# EAGLE design furby_shield_v1b (EAGLE 6.3)
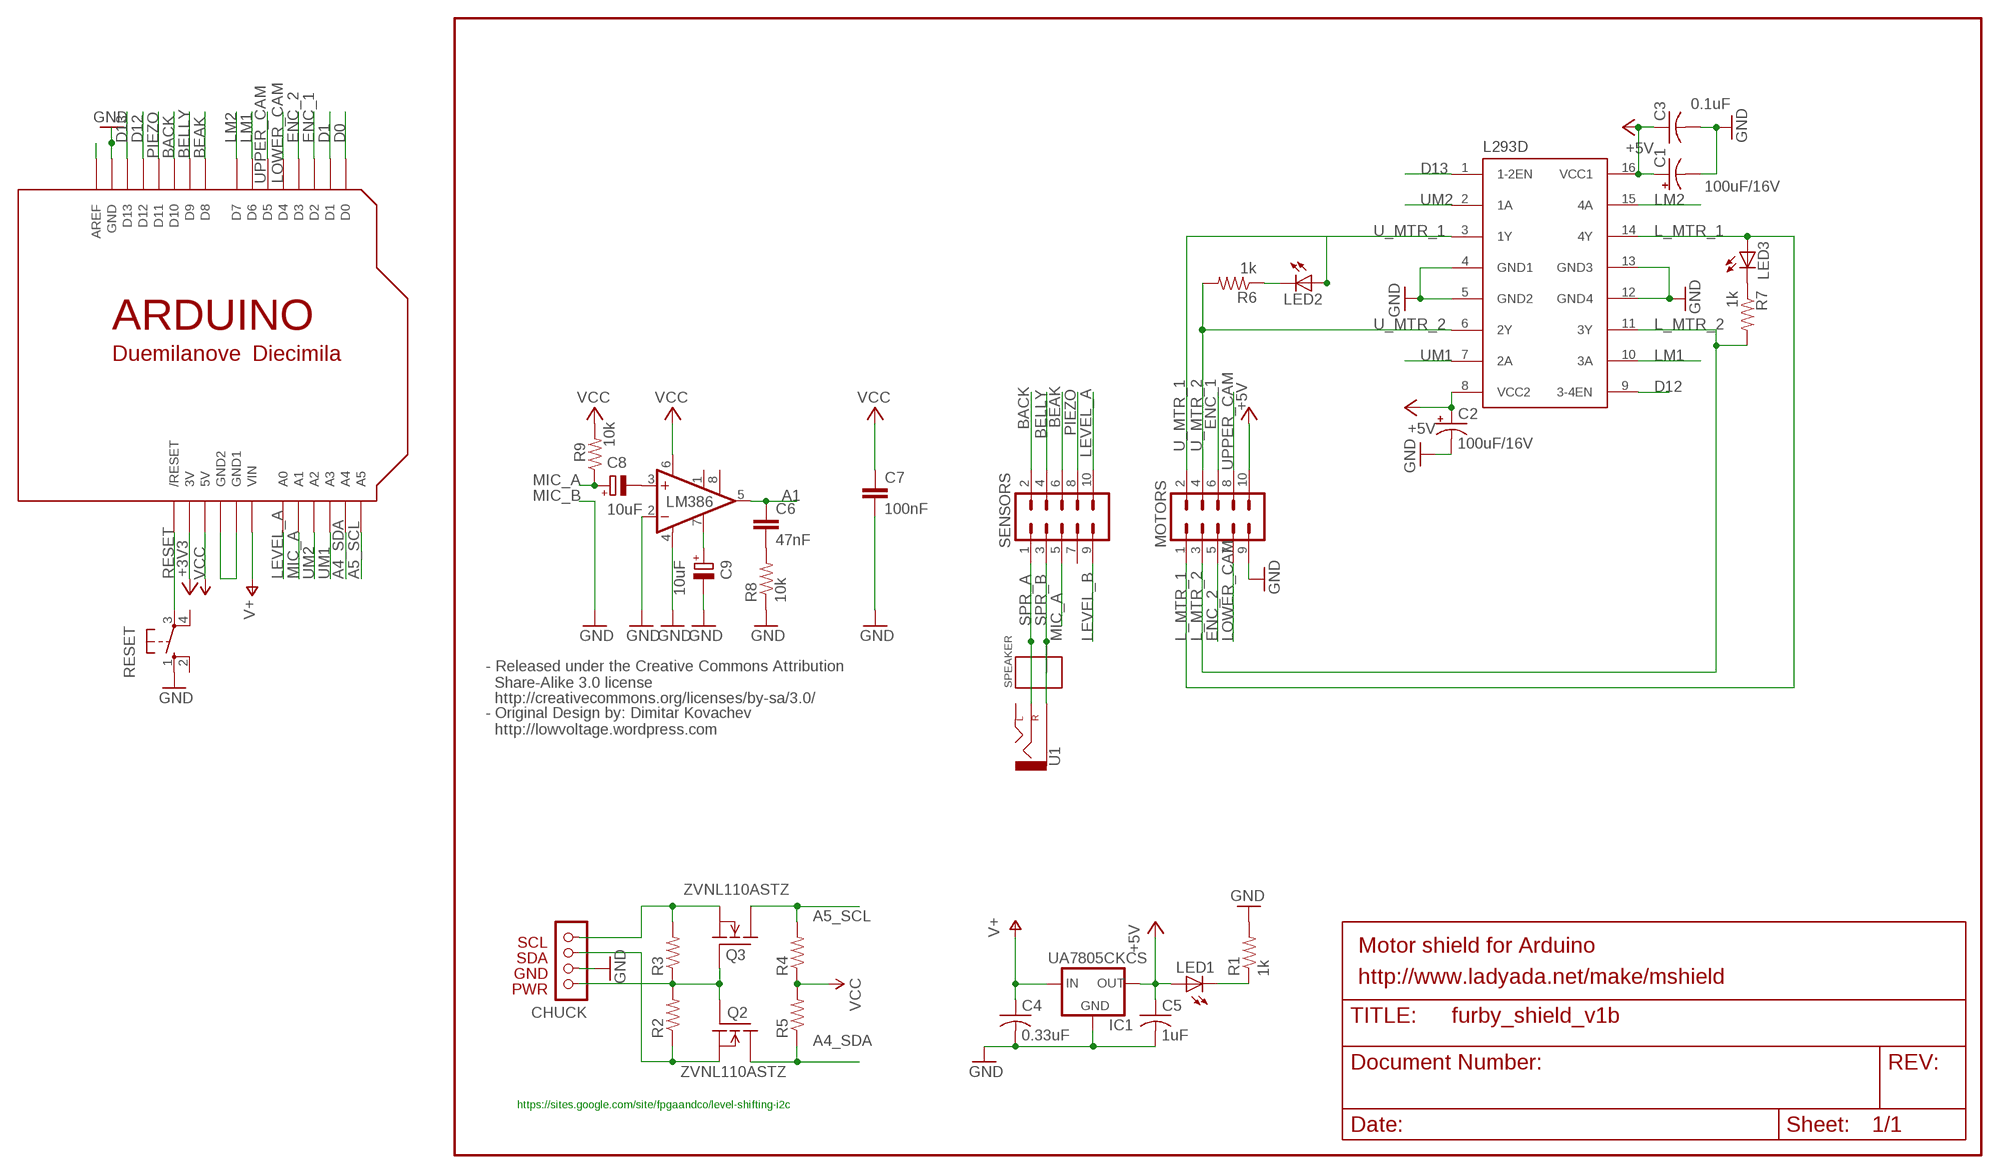
[diagram p0: schematic, sheet 1]

## Parts
C1  100uF/16V  CPOL-USE2.5-6  [E2,5-6]
C2  100uF/16V  CPOL-USE2.5-6  [E2,5-6]
C3  0.1uF  C-US025-025X050  [C025-025X050]
C4  0.33uF  C-US025-024X044  [C025-024X044]
C5  1uF  C-US025-024X044  [C025-024X044]
C6  47nF  C-EU025-030X050  [C025-030X050]
C7  100nF  C-EU025-025X050  [C025-025X050]
C8  10uF  CPOL-EUE2.5-6  [E2,5-6]
C9  10uF  CPOL-EUE2.5-6  [E2,5-6]
CHUCK  NUNCHUCK  [CONN]
IC1  UA7805CKCS  V_REG_78XX-TO-220  [TO-220-ALT]
L293D  L293E  [DIL16]
LED1  LED3MM  [LED3MM]
LED2  LED3MM  [LED3MM]
LED3  LED3MM  [LED3MM]
LM386  LM386N-1  [DIL08]
MOTORS  M05X2SHD  [2X5-SHROUDED]
Q2  ZVNL110ASTZ  FQN1N50CI  [TO92-INLINE]
Q3  ZVNL110ASTZ  FQN1N50CI  [TO92-INLINE]
R1  1k  R-US_0204/5  [0204/5]
R2  R-US_0204/7  [0204/7]
R3  R-US_0204/7  [0204/7]
R4  R-US_0204/7  [0204/7]
R5  R-US_0204/7  [0204/7]
R6  1k  R-US_0204/5  [0204/5]
R7  1k  R-US_0204/5  [0204/5]
R8  10k  R-US_0204/7  [0204/7]
R9  10k  R-US_0204/7  [0204/7]
RESET  10-XX  [B3F-10XX]
SENSORS  M05X2SHD  [2X5-SHROUDED]
SPEAKER  TERMINAL2  [TERMINAL_2]
U1  AUDIO-JACKPTH  [AUDIO-JACK]
U$1  ARDUINO-NOHOLE  [ARDUINO-NOHOLE]

## Nets
+3V3: CHUCK.PWR Q2.2(G) Q3.2(G) R2.2 R3.1 U$1.3V
+5V: C1.+ C2.+ C3.1 C5.1 IC1.OUT L293D.8(VCC2) L293D.16(VCC1) LED1.A MOTORS.10
A1: C6.1 LM386.5(OUT)
A4_SDA: Q2.1(D) R5.1 U$1.A4
A5_SCL: Q3.1(D) R4.2 U$1.A5
BACK: SENSORS.2 U$1.D10
BEAK: SENSORS.6 U$1.D8
BELLY: SENSORS.4 U$1.D9
D0: U$1.D0
D1: U$1.D1
D12: L293D.9(3-4EN) U$1.D12
D13: L293D.1(1-2EN) U$1.D13
ENC_1: MOTORS.6 U$1.D2
ENC_2: MOTORS.5 U$1.D3
GND [power]: C1.- C2.- C3.2 C4.2 C5.2 C7.2 C9.- CHUCK.GND IC1.GND L293D.4(GND1) L293D.5(GND2) L293D.12(GND4) L293D.13(GND3) LM386.2(-IN) LM386.4(GND) MOTORS.9 R1.2 R8.1 RESET.1(S) U$1.GND U$1.GND1 U$1.GND2
L_MTR_1: L293D.14(4Y) LED3.A MOTORS.1
L_MTR_2: L293D.11(3Y) MOTORS.3 R7.2
LEVEL_A: SENSORS.10 U$1.A0
LEVEL_B: SENSORS.9
LM1: L293D.10(3A) U$1.D6
LM2: L293D.15(4A) U$1.D7
LOWER_CAM: MOTORS.7 U$1.D4
MIC_A: C8.+ R9.1 SENSORS.5 U$1.A1
N$1: LED2.K(C) R6.1
N$2: LED1.K(C) R1.1
N$3: LED3.K(C) R7.1
N$4: C6.2 R8.2
N$6: C9.+ LM386.7(BYPASS)
N$8: C8.- LM386.3(+IN)
PIEZO: SENSORS.8 U$1.D11
RESET: RESET.3(P) U$1.RESET(/RESET)
SCL: CHUCK.SCL Q3.3(S) R3.2
SDA: CHUCK.SDA Q2.3(S) R2.1
SPR_A: SENSORS.1 SPEAKER.P$1 U1.RING(RIGHT)
SPR_B: SENSORS.3 SPEAKER.P$2 U1.SLEEVE
U_MTR_1: L293D.3(1Y) LED2.A MOTORS.2
U_MTR_2: L293D.6(2Y) MOTORS.4 R6.2
UM1: L293D.7(2A) U$1.A3
UM2: L293D.2(1A) U$1.A2
UPPER_CAM: MOTORS.8 U$1.D5
V+: C4.1 IC1.IN U$1.VIN
VCC: C7.1 LM386.6(VS) R4.1 R5.2 R9.2 U$1.5V U$1.AREF
Unconnected: LM386.1(GAIN) LM386.8(GAIN) RESET.2(S1) RESET.4(P1) SENSORS.7 U1.TIP(LEFT)

## Notes on the sheet
- - Released under the Creative Commons Attribution
    Share-Alike 3.0 license
- http://creativecommons.org/licenses/by-sa/3.0/
- - Original Design by: Dimitar Kovachev
    http://lowvoltage.wordpress.com
- Motor shield for Arduino
- http://www.ladyada.net/make/mshield
- https://sites.google.com/site/fpgaandco/level-shifting-i2c

## Library data of the parts
C1 C2 = rcl-ez:CPOL-US: POLARIZED CAPACITOR, American symbol
C3 = rcl-ez:C-US: CAPACITOR, American symbol
C4 C5 = adafruit:C-US: CAPACITOR, American symbol
C6 C7 = rcl:C-EU: CAPACITOR, European symbol
C8 C9 = rcl:CPOL-EU: POLARIZED CAPACITOR, European symbol
CHUCK = _my-parts:NUNCHUCK
IC1 = SparkFun:V_REG_78XX: Voltage Regulator Standard 7805 5V regulator. IGO (Input Ground Output). Spark Fun Electronics SKU : COM-00107
L293D = texas:L293E: TI DEVICE
LED1-LED3 = adafruit:LED: LED OSRAM: - CHIPLED LG R971, LG N971, LY N971, LG Q971, LY Q971, LO R971, LY R971 LH N974, LH R974 LS Q976, LO Q976, LY Q976 LO Q996 - Hyper CHIPLED LW Q18S LB Q993, LB Q99A, LB R99A - SideLED LS A670, LO A670, LY A670, LG A670, LP A670 LB A673, LV A673, LT A673, LW A673 LH A674 LY A675 LS A676, LA A676, LO A676, LY A676, LW A676 LS A679, LY A679, LG A679 - Hyper Micro SIDELED® LS Y876, LA Y876, LO Y876, LY Y876 LT Y87S - SmartLED LW L88C, LW L88S LB L89C, LB L89S, LG L890 LS L89K, LO L89K, LY L89K LS L896, LA L896, LO L896, LY L896 - TOPLED LS T670, LO T670, LY T670, LG T670, LP T670 LSG T670, LSP T670, LSY T670, LOP T670, LYG T670 LG T671, LOG T671, LSG T671 LB T673, LV T673, LT T673, LW T673 LH T674 LS T676, LA T676, LO T676, LY T676, LB T676, LH T676, LSB T676, LW T676 LB T67C, LV T67C, LT T67C, LS T67K, LO T67K, LY T67K, LW E67C LS E67B, LA E67B, LO E67B, LY E67B, LB E67C, LV E67C, LT E67C LW T67C LS T679, LY T679, LG T679 LS T770, LO T770, LY T770, LG T770, LP T770 LB T773, LV T773, LT T773, LW T773 LH T774 LS E675, LA E675, LY E675, LS T675 LS T776, LA T776, LO T776, LY T776, LB T776 LHGB T686 LT T68C, LB T68C - Hyper Mini TOPLED® LB M676 - Mini TOPLED Santana® LG M470 LS M47K, LO M47K, LY M47K Source: http://www.osram.convergy.de/
LM386 = linear:LM386?-*: Low Voltage Audio Power Amplifier Source: http://cache.national.com/ds/LM/LM386.pdf
MOTORS SENSORS = SparkFun_mod:M05X2: Header 5x2 Standard 10-pin dual row 0.1" header. Commonly used with AVR-ISP. Use with Spark Fun Electronics SKU: PRT-00778
Q2 Q3 = adafruit:FQN1N50C: N-Channel Enhancement MOSFET 500V, 0.4A, 6.0 Ohm
R1-R9 = adafruit:R-US_: RESISTOR, American symbol
RESET = switch-omron:10-XX: OMRON SWITCH
SPEAKER = _my-parts:TERMINAL2
U1 = SparkFun:AUDIO-JACK: 3.5mm Audio Jack Simple 3.5mm common PCB mount audio jack. SKU: PRT-08032
U$1 = adafruit:ARDUINO: Arduino Diecimila/Duemilanove Make a shield with ease, this package has all the named pins as well as the two mounting drill holes and an outline of the USB and DC power connector. The outline is on the DIMENSION layer, so if your board house uses it they will cut the outline to match. http://www.ladyada.net/library/pcb/eaglelibrary.html

## Net classes
1 power: width 0.61 mm

## Board
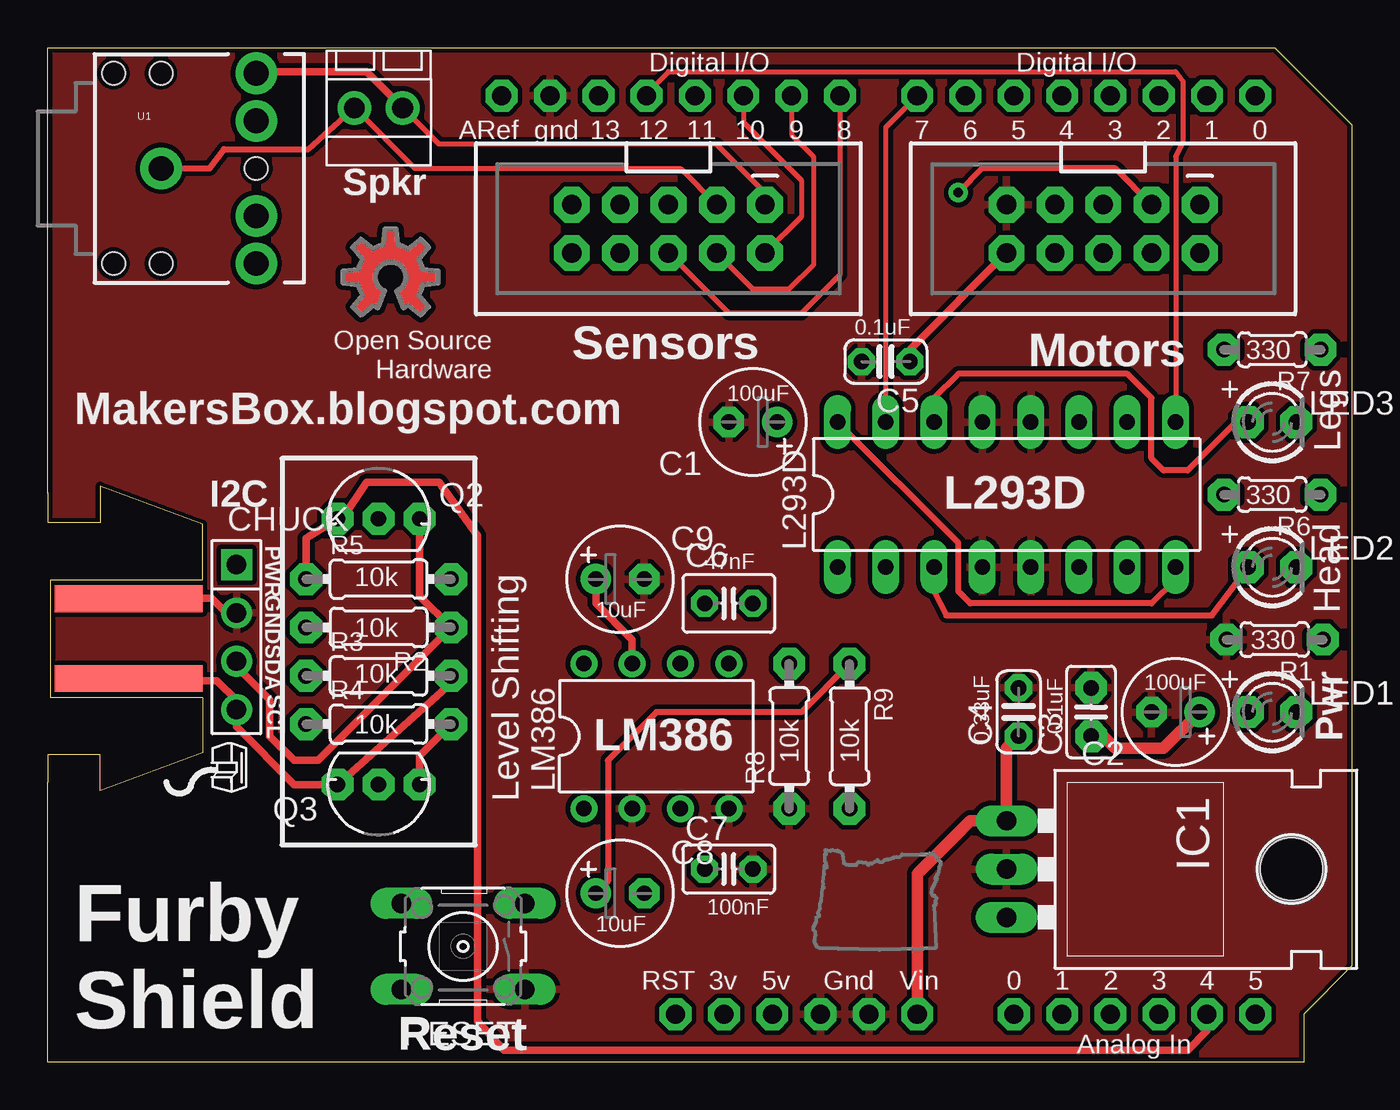
[diagram p1: board, top side]
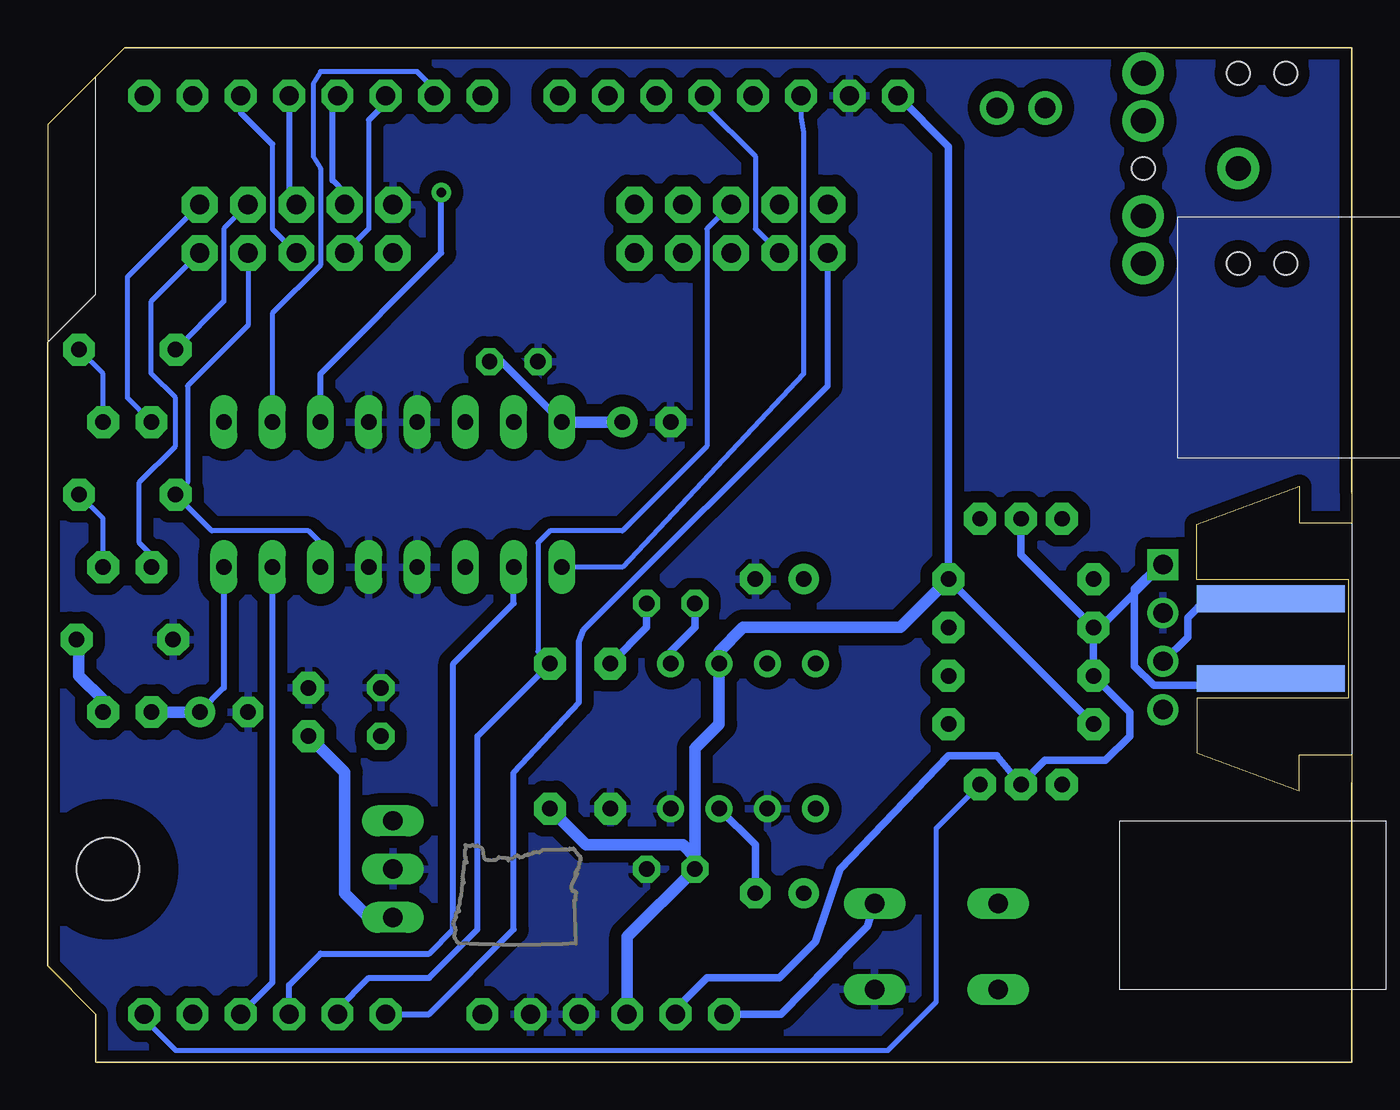
[diagram p2: board, bottom side, seen from below]

Size 68.59 x 53.34 mm. Coordinates in mm from the lower left corner, seen from the top.
Outline: 0.01,14.73 0.01,0 66.05,0 66.05,2.54 68.59,5.08 68.59,49.28 64.52,53.34 0.01,53.34 0.01,29.91
Copper layers (1*16): Top 0.035mm / dielectric 1.5mm / Bottom 0.035mm
Design rules "SparkFun": minimum track width 8mil, minimum drill 20mil, track to track 8mil, track to pad 8mil, pad to pad 8mil, via to via 8mil, smd to smd 8mil, copper to edge 10mil, drill to drill 8mil, minimum pad ring 12mil, minimum via ring 10mil, stop-mask expansion 4mil, vias tented up to drill 25mil, thermal gap 10mil

### Footprints (pad centres in the part's own frame; a part is rotated, then mirrored left to right if it is on the bottom)
E2,5-6 = drill 0.813 pad 1.6: + -1.27,0 | drill 0.813 pad 1.6 octagon: - 1.27,0
C025-025X050 = drill 0.813 pad 1.676 octagon: 1 -1.27,0; 2 1.27,0
C025-024X044 = drill 0.813 pad 1.422 octagon: 1 -1.27,0; 2 1.27,0
C025-030X050 = drill 0.813 octagon: 1 -1.27,0; 2 1.27,0
C025-025X050' = drill 0.813 octagon: 1 -1.27,0; 2 1.27,0
CONN = drill 1.016: GND -0.23,6.35; SCL -0.23,1.27; SDA -0.23,3.81 | smd 7.8 x 1.4 bottom: P$1_SDA -5.9,7.1; P$4_VCC -5.9,2.9 | smd 7.8 x 1.4: P$2_SCL -5.9,2.9; P$3_GND -5.9,7.1 | drill 1.016 square: PWR -0.23,8.89
TO-220-ALT = drill 1.016 long: GND 0,-3.81; IN -2.54,-3.81; OUT 2.54,-3.81 | hole 3.302: 0,11.176
DIL16 = drill 0.813 long: 1 -8.89,-3.81; 2 -6.35,-3.81; 3 -3.81,-3.81; 4 -1.27,-3.81; 5 1.27,-3.81; 6 3.81,-3.81; 7 6.35,-3.81; 8 8.89,-3.81; 9 8.89,3.81; 10 6.35,3.81; 11 3.81,3.81; 12 1.27,3.81; 13 -1.27,3.81; 14 -3.81,3.81; 15 -6.35,3.81; 16 -8.89,3.81
LED3MM = drill 0.813 pad 1.676 octagon: A -1.27,0; K 1.27,0
DIL08 = drill 0.813 pad 1.27: 1 -3.81,-3.81; 2 -1.27,-3.81; 3 1.27,-3.81; 4 3.81,-3.81; 5 3.81,3.81; 6 1.27,3.81; 7 -1.27,3.81; 8 -3.81,3.81
2X5-SHROUDED = drill 1.016 pad 1.88 octagon: 1 -1.27,5.08; 2 1.27,5.08; 3 -1.27,2.54; 4 1.27,2.54; 5 -1.27,0; 6 1.27,0; 7 -1.27,-2.54; 8 1.27,-2.54; 9 -1.27,-5.08; 10 1.27,-5.08
TO92-INLINE = drill 0.813 pad 1.676 octagon: 1 -2.159,0; 2 0,0; 3 2.159,0
0204/5 = drill 0.813 pad 1.676 octagon: 1 -2.54,0; 2 2.54,0
0204/7 = drill 0.813 pad 1.676 octagon: 1 -3.81,0; 2 3.81,0
B3F-10XX = drill 1.016 long: 1 -3.251,2.261; 2 3.251,2.261; 3 -3.251,-2.261; 4 3.251,-2.261
TERMINAL_2 = drill 1.1 pad 1.778: P$1 1.27,0; P$2 -1.27,0
AUDIO-JACK = drill 1.3 pad 2.184: RING 5,5; RSH 5,2.5; SLEEVE 0,0; TIP 5,-5; TSH 5,-2.5 | hole 1.2: 0,5; -2.5,5; -2.5,-5; 0,-5; 5,0
ARDUINO-NOHOLE = drill 1 pad 1.676 octagon: 3V 35.56,2.54; 5V 38.1,2.54; A0 50.8,2.54; A1 53.34,2.54; A2 55.88,2.54; A3 58.42,2.54; A4 60.96,2.54; A5 63.5,2.54; AREF 23.876,50.8; D0 63.5,50.8; D1 60.96,50.8; D2 58.42,50.8; D3 55.88,50.8; D4 53.34,50.8; D5 50.8,50.8; D6 48.26,50.8; D7 45.72,50.8; D8 41.656,50.8; D9 39.116,50.8; D10 36.576,50.8; D11 34.036,50.8; D12 31.496,50.8; D13 28.956,50.8; GND 26.416,50.8; GND1 43.18,2.54; GND2 40.64,2.54; RESET 33.02,2.54; VIN 45.72,2.54

### Placement (x,y rotation side)
C1  37.09,33.66 180 top
C2  59.31,18.41 180 top
C3  54.87,18.41 90 top
C4  51.06,18.41 90 top
C5  44.07,36.83 180 top
C6  35.82,24.13 0 top
C7  100nF  [C025-025X050']  35.82,10.16 0 top
C8  30.1,8.89 0 top
C9  30.1,25.4 0 top
CHUCK  10.17,17.27 0 top
IC1  54.23,10.16 270 top
L293D  50.42,29.84 0 top
LED1  64.39,18.41 0 top
LED2  64.39,26.04 0 top
LED3  64.39,33.66 0 top
LM386  32.01,17.14 0 top
MOTORS  55.5,43.81 270 top
Q2  17.4,28.57 0 top
Q3  17.4,14.61 180 top
R1  64.52,22.23 180 top
R2  17.4,22.86 180 top
R3  17.4,20.32 0 top
R4  17.4,17.78 0 top
R5  17.4,25.4 0 top
R6  64.39,29.84 180 top
R7  64.39,37.47 180 top
R8  38.99,17.14 90 top
R9  42.17,17.14 270 top
RESET  21.85,6.1 180 top
SENSORS  32.64,43.81 270 top
SPEAKER  17.4,50.16 0 top
U1  5.97,46.99 0 top
U$1  0.01,0 0 top
U$2  [OSHWLOGO_TOP_0.2]  18.04,41.27 0 top
U$3  [OREGON_18_51]  40.9,11.18 0 top
U$4  [OREGON_18_52]  46.61,11.43 0 top

### Tracks (layer width: path | path; a pad name or v marks a point on that pad's centre or on a via)
+3V3
  Bottom 0.406: R2.2 R3.1 11.69,18.41 11.69,17.14 12.96,15.88 16.13,15.88 Q3.2 18.67,16.13 21.21,16.13 26.93,10.16 28.2,6.35 30.1,4.45 33.91,4.45 35.57,2.79 U$1.3V | R2.2 17.4,26.67 Q2.2 | R2.2 13.24,22.86 CHUCK.PWR
+5V
  Top 0.305: L293D.8 59.31,25.4 58.04,24.13 48.52,24.13 47.88,24.77 47.88,27.3 L293D.16
  Top 0.406: C5.1 45.34,37.47 MOTORS.10
  Top 0.61: C3.1 55.5,17.14 56.14,16.51 58.68,16.51 C2.+
  Bottom 0.305: L293D.8 59.31,19.68 C2.+
  Bottom 0.406: L293D.16 44.71,36.83 C5.1
  Bottom 0.61: IC1.OUT 51.69,7.62 52.96,8.89 52.96,15.24 C3.1 | C2.+ LED1.A | C1.+ L293D.16
A1
  Bottom 0.406: LM386.5 35.82,21.59 34.55,22.86 C6.1
A4_SDA
  Top 0.406: R5.1 13.59,27.56 Q2.1 15.5,28.83 15.5,28.57 16.77,30.48 20.58,30.48 22.61,27.69 22.61,2.16 24.01,0.64 59.95,0.64 60.97,1.65 U$1.A4
A5_SCL
  Top 0.406: Q3.1 19.56,16.13 R4.2
  Bottom 0.254: U$1.A5 63.51,2.29 61.85,0.64 24.39,0.64 21.85,3.17 21.85,12.32 Q3.1
BACK
  Top 0.254: U$1.D10 36.58,49.4 39.63,46.35 39.63,44.45 SENSORS.2
BEAK
  Top 0.254: U$1.D8 41.66,41.4 39.63,39.37 35.82,39.37 SENSORS.6
BELLY
  Top 0.254: U$1.D9 39.12,48.77 40.26,47.62 40.26,41.91 38.99,40.64 37.09,40.64 SENSORS.4
D12
  Top 0.254: U$1.D12 31.5,50.93 32.64,52.07 59.31,52.07 59.7,51.56 59.7,48.39 59.31,47.62 L293D.9
D13
  Bottom 0.254: L293D.1 38.36,26.04 28.83,36.2 28.83,48.9 28.96,49.66 U$1.D13
ENC_1
  Bottom 0.254: 56.77,48.26 56.77,43.81 MOTORS.6
  Bottom 0.305: U$1.D2 58.43,49.91 56.77,48.26
ENC_2
  Bottom 0.305: U$1.D3 55.89,45.47 MOTORS.5
GND
  pour Bottom (isolate 0.635): -5.07,58.42 71.13,58.42 71.13,-3.05 -5.07,-3.17
  pour Top (isolate 0.254): -3.8,57.15 69.6,57.53 69.98,-1.65 -3.8,-1.65
L_MTR_1
  Top 0.305: LED3.A 62.49,33.66 59.95,31.11 58.68,31.11 58.04,31.75 58.04,34.92 56.77,36.2 47.88,36.2 46.61,34.92 L293D.14
  Bottom 0.254: MOTORS.1 64.39,41.27 64.39,34.92 LED3.A
L_MTR_2  (via drill 0.51)
  Top 0.305: MOTORS.3 56.14,46.99 49.15,46.99 v47.88,45.72
  Bottom 0.254: MOTORS.3 59.31,43.81 59.31,40.01 R7.2
  Bottom 0.305: L293D.11 54.23,36.2 47.88,42.55 v47.88,45.72
LEVEL_A
  Bottom 0.305: U$1.A0 48.52,2.54 44.07,6.99 44.07,15.24 40.65,18.92 40.65,22.1 40.39,22.73 27.56,35.56 SENSORS.10
LM1
  Bottom 0.254: U$1.D6 48.27,51.18 49.15,52.07 54.23,52.07 54.62,51.44 54.62,47.62 54.23,46.99 54.23,41.91 56.77,39.37 L293D.10
LM2
  Top 0.254: L293D.15 44.07,49.15 U$1.D7
LOWER_CAM
  Bottom 0.305: MOTORS.7 52.96,45.72 53.6,46.35 53.6,50.55 U$1.D4
MIC_A
  Top 0.305: R9.1 39.63,18.41 32.01,18.41 29.47,15.88 29.47,9.53 C8.+
  Bottom 0.254: SENSORS.5 33.91,43.81 33.91,32.38 38.36,27.94 42.17,27.94 42.8,27.3 42.8,21.59 R9.1
  Bottom 0.305: U$1.A1 53.35,2.79 51.69,4.45 48.52,4.45 45.98,6.99 45.98,17.14 R9.1
N$1
  Bottom 0.254: LED2.K 65.66,28.57 R6.1
N$2
  Bottom 0.61: LED1.K 65.66,19.05 66.93,20.32 66.93,22.1 R1.1
N$3
  Bottom 0.254: LED3.K 65.66,36.2 R7.1
N$4
  Bottom 0.406: R8.2 37.09,22.86 C6.2
N$6
  Top 0.406: C9.+ 28.83,24.13 30.74,22.23 LM386.7
N$8
  Bottom 0.406: C8.- 31.37,11.43 LM386.3
PIEZO
  Bottom 0.254: U$1.D11 34.04,50.29 31.37,47.62 31.37,43.81 SENSORS.8
RESET
  Bottom 0.406: U$1.RESET 30.03,2.54 26.29,6.35 25.48,7.16 RESET.3
SCL
  Top 0.406: CHUCK.SCL 9.94,17.63 12.96,14.61 Q3.3 | Q3.3 15.25,14.35 | R3.2 21.21,19.94 Q3.3
SDA
  Top 0.406: Q2.3 19.56,24.51 R2.1 14.23,15.88 12.96,15.88 11.69,17.14 11.69,19.05 9.94,20.8 CHUCK.SDA
SPR_A
  Top 0.254: SENSORS.1 37.72,45.72 35.18,48.26 20.58,48.26 SPEAKER.P$1
  Top 0.406: SPEAKER.P$1 16.77,52.07 11.05,52.07 U1.RING
SPR_B
  Top 0.254: SPEAKER.P$2 19.31,46.99 33.28,46.99 SENSORS.3
  Top 0.305: U1.SLEEVE 8.51,46.99 9.28,48.01 13.72,48.01 SPEAKER.P$2
U_MTR_1
  Top 0.305: L293D.3 46.61,24.77 47.25,23.5 61.22,23.5 LED2.A
  Bottom 0.254: LED2.A 63.12,26.67 63.76,27.3 63.76,30.48 61.85,32.38 61.85,34.92 63.12,36.2 63.12,40.01 MOTORS.2
U_MTR_2
  Bottom 0.254: MOTORS.4 58.04,38.73 61.22,35.56 61.22,30.48 R6.2 59.95,27.94 54.87,27.94 54.23,27.3 L293D.6
UM1
  Bottom 0.305: L293D.7 56.77,4.19 U$1.A3
UM2
  Bottom 0.305: U$1.A2 55.89,4.06 54.23,5.71 48.52,5.71 47.25,6.99 47.25,20.95 44.07,24.13 L293D.2
UPPER_CAM
  Bottom 0.254: 51.69,49.53 51.69,43.81 MOTORS.8
  Bottom 0.305: U$1.D5 50.81,50.42 51.69,49.53
V+
  Top 0.61: U$1.VIN 45.73,9.91 48.52,12.7 IC1.IN 50.42,16.51 C4.1
VCC
  Bottom 0.406: R4.1 R5.2 21.21,48.13 U$1.AREF
  Bottom 0.61: U$1.5V 38.11,6.6 C7.1 | C7.1 34.55,10.79 35.18,11.43 40.26,11.43 R9.2 | C7.1 34.55,16.51 33.28,17.78 LM386.6 33.28,21.59 32.01,22.86 23.75,22.86 R5.2

### Text on the board
tPlace: Spkr | Open Source / Hardware | 0.1uF | Sensors | Motors | 330 | 100uF | Legs | MakersBox.blogspot.com | I2C | L293D | 330 | 47nF | 10k | Head | 10uF | 10k | 330 | 10k | 0.1uF | 100uF | 10k | 0.33uF | Pwr | LM386 | 10k | 10k | Level Shifting | 100nF | 10uF | Furby / Shield | Reset
bDocu: MakersBox.blogspot.com | Furby Shield / Rev 0 / May '13 | Designed and / Manufactured / in OREGON